# EAGLE design master (EAGLE 6.4)

## Sheet 1 of 2
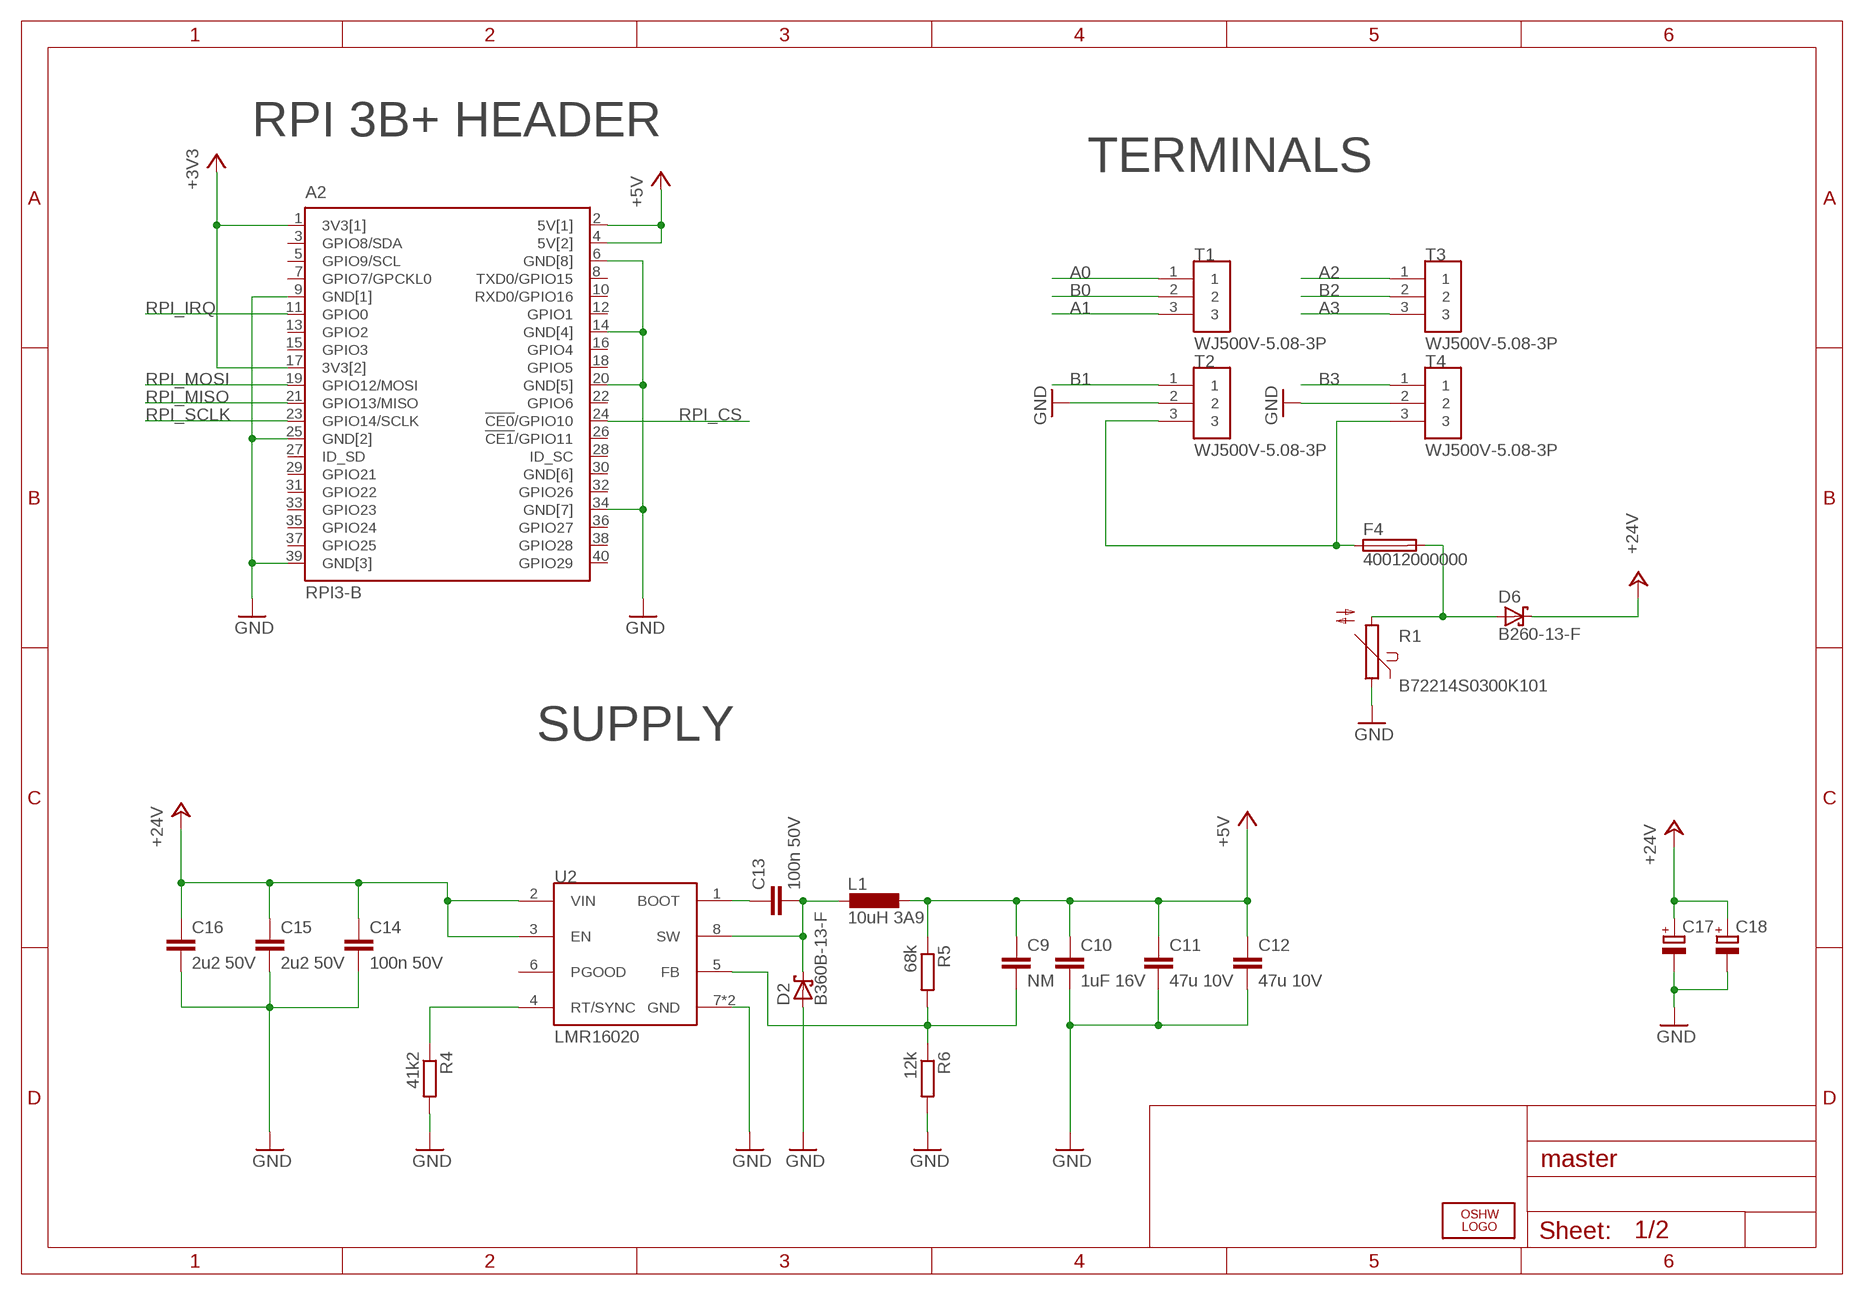
[diagram p0: schematic, sheet 1]

### Parts
A2  RPI3-B  [RPI3-B]
C9  NM  C-EUC0805  [C0805]
C10  1uF 16V  C-EUC0805  [C0805]
C11  47u 10V  C-EUC1210  [C1210]
C12  47u 10V  C-EUC1210  [C1210]
C13  100n 50V  C-EUC1206  [C1206]
C14  100n 50V  C-EUC1206  [C1206]
C15  2u2 50V  C-EUC1206  [C1206]
C16  2u2 50V  C-EUC1206  [C1206]
C17  CPOL-EUUD-5X5,8  [UD-5X5,8_NICHICON]
C18  CPOL-EUUD-5X5,8  [UD-5X5,8_NICHICON]
D2  B360B-13-F  MBRS130LT3  [SMB]
D6  B260-13-F  MBRS130LT3  [SMB]
F4  40012000000  [400]
L1  10uH 3A9  1217AS-H-100M=P3  [1217AS]
LOGO1  OSHW_LOGO_FILLX0350-NT  [OSHW_FILLX350_NOTEXT]
R1  B72214S0300K101  S14K300  [S14K300]
R4  41k2  R-EU_R1206  [R1206]
R5  68k  R-EU_R1206  [R1206]
R6  12k  R-EU_R1206  [R1206]
T1  WJ500V-5.08-3P  [WJ500V-5.08-3P]
T2  WJ500V-5.08-3P  [WJ500V-5.08-3P]
T3  WJ500V-5.08-3P  [WJ500V-5.08-3P]
T4  WJ500V-5.08-3P  [WJ500V-5.08-3P]
U2  LMR16020  [SOIC127P600X170-8N]

### Nets
+3V3: A2.1(3V3[1]) A2.17(3V3[2]) ; also sheet 2
+5V: A2.2(5V[1]) A2.4(5V[2]) C9.1 C10.1 C11.1 C12.1 L1.1 R5.1
+24V: C14.1 C15.1 C16.1 C17.+ C18.+ D6.C U2.2(VIN) U2.3(EN)
A0: T1.1 ; also sheet 2
A1: T1.3 ; also sheet 2
A2: T3.1 ; also sheet 2
A3: T3.3 ; also sheet 2
B0: T1.2 ; also sheet 2
B1: T2.1 ; also sheet 2
B2: T3.2 ; also sheet 2
B3: T4.1 ; also sheet 2
GND: A2.6(GND[8]) A2.9(GND[1]) A2.14(GND[4]) A2.20(GND[5]) A2.25(GND[2]) A2.34(GND[7]) A2.39(GND[3]) C10.2 C11.2 C12.2 C14.2 C15.2 C16.2 C17.- C18.- D2.A R1.1 R4.2 R6.2 T2.2 T4.2 U2.7(GND) U2.9(GND) ; also sheet 2
N$7: R4.1 U2.4(RT/SYNC)
N$8: C9.2 R5.2 R6.1 U2.5(FB)
N$9: C13.2 D2.C L1.2 U2.8(SW)
N$10: C13.1 U2.1(BOOT)
N$19: F4.P$1 T2.3 T4.3
N$20: D6.A F4.P$2 R1.2
RPI_CS: A2.24(!CE0!/GPIO10) ; also sheet 2
RPI_IRQ: A2.11(GPIO0) ; also sheet 2
RPI_MISO: A2.21(GPIO13/MISO) ; also sheet 2
RPI_MOSI: A2.19(GPIO12/MOSI) ; also sheet 2
RPI_SCLK: A2.23(GPIO14/SCLK) ; also sheet 2
Unconnected: A2.3(GPIO8/SDA) A2.5(GPIO9/SCL) A2.7(GPIO7/GPCKL0) A2.8(TXD0/GPIO15) A2.10(RXD0/GPIO16) A2.12(GPIO1) A2.13(GPIO2) A2.15(GPIO3) A2.16(GPIO4) A2.18(GPIO5) A2.22(GPIO6) A2.26(!CE1!/GPIO11) A2.27(ID_SD) A2.28(ID_SC) A2.29(GPIO21) A2.31(GPIO22) A2.32(GPIO26) A2.33(GPIO23) A2.35(GPIO24) A2.36(GPIO27) A2.37(GPIO25) A2.38(GPIO28) A2.40(GPIO29) U2.6(PGOOD)

### Notes on the sheet
- RPI 3B+ HEADER
- TERMINALS
- SUPPLY

## Sheet 2 of 2
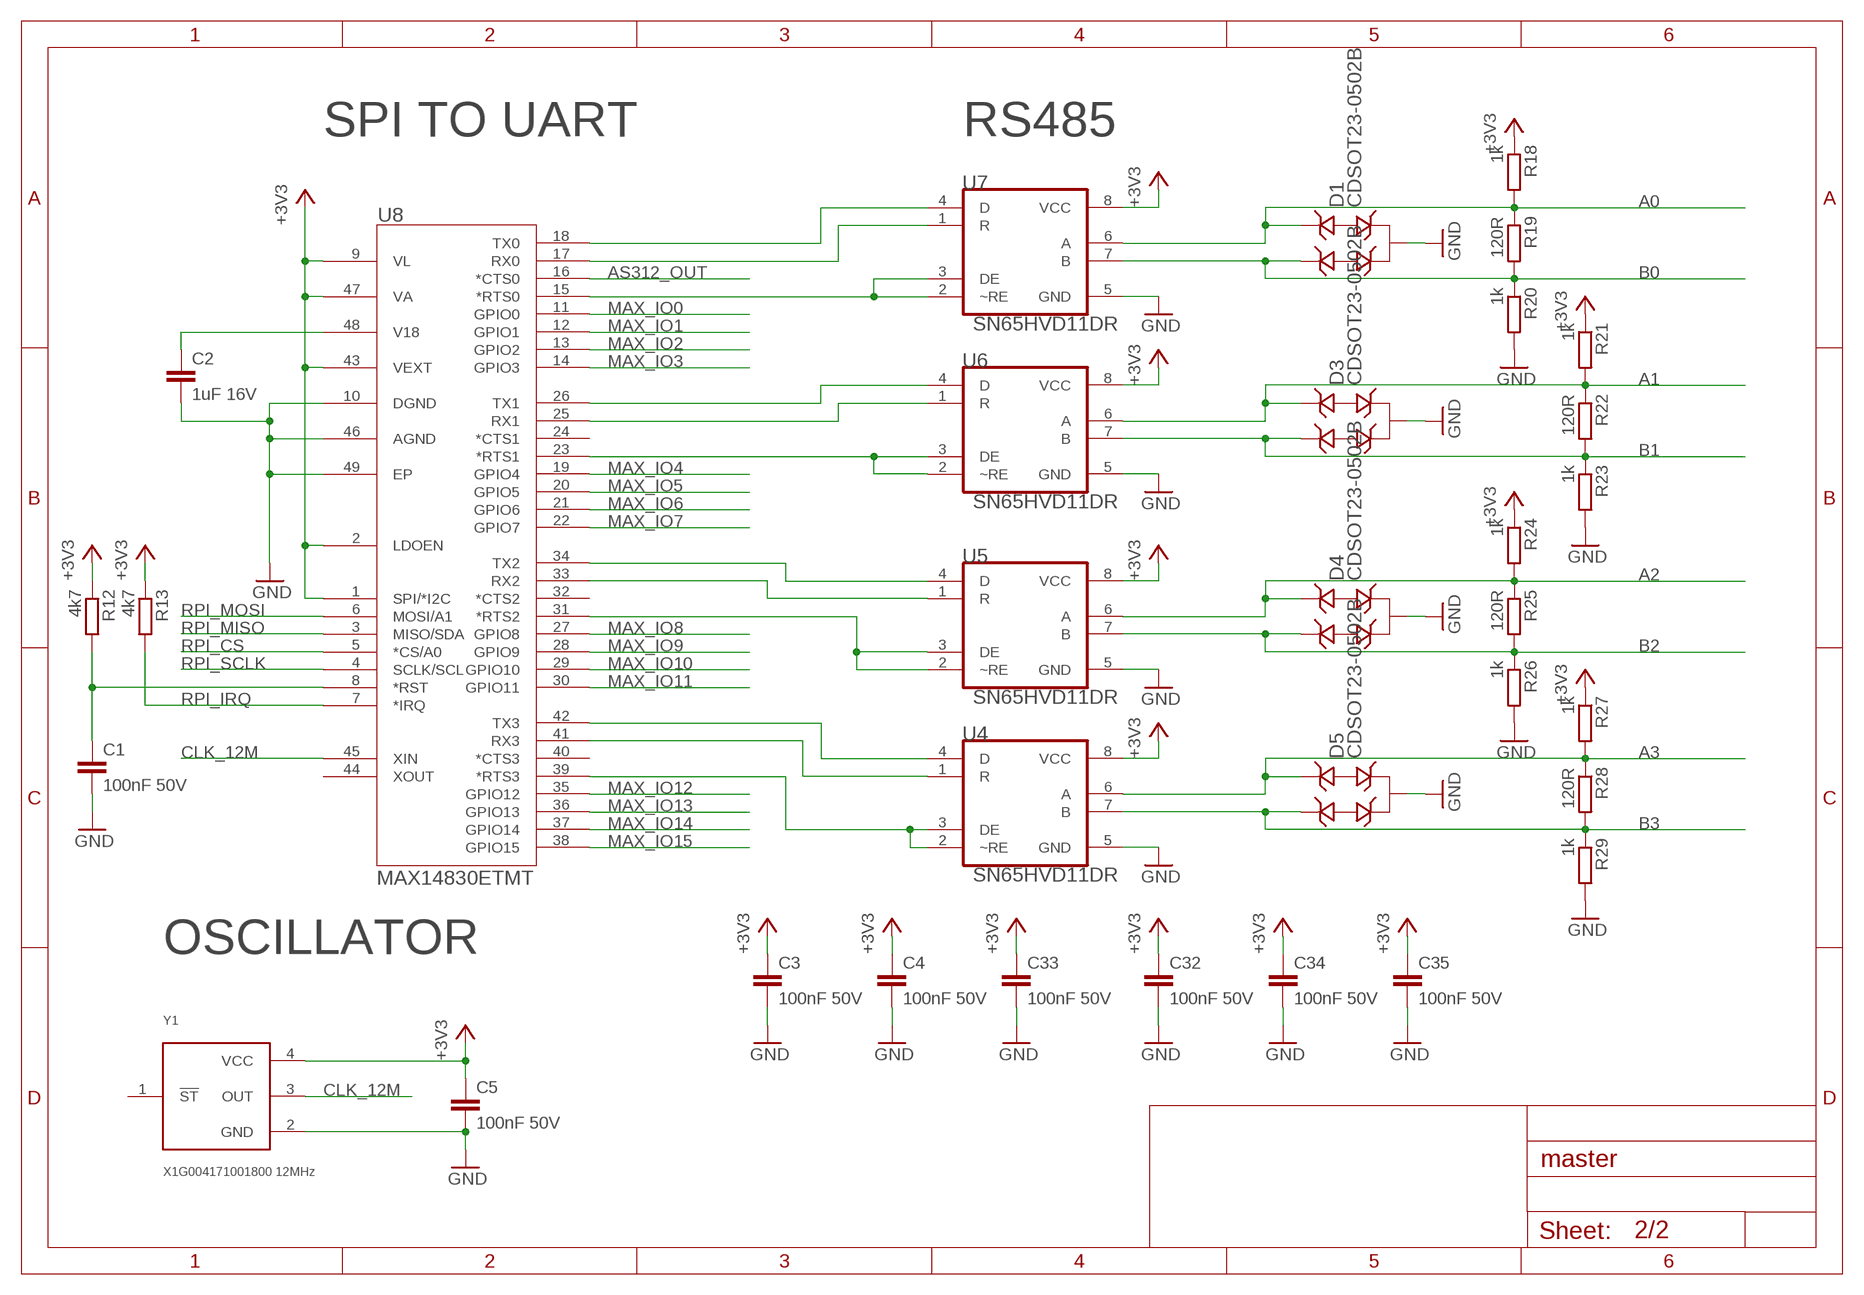
[diagram p1: schematic, sheet 2]

### Parts
C1  100nF 50V  C-EUC0805  [C0805]
C2  1uF 16V  C-EUC0805  [C0805]
C3  100nF 50V  C-EUC0805  [C0805]
C4  100nF 50V  C-EUC0805  [C0805]
C5  100nF 50V  C-EUC0805  [C0805]
C32  100nF 50V  C-EUC0805  [C0805]
C33  100nF 50V  C-EUC0805  [C0805]
C34  100nF 50V  C-EUC0805  [C0805]
C35  100nF 50V  C-EUC0805  [C0805]
D1  CDSOT23-0502B  CDSOT23-SM712  [SOT-23-3]
D3  CDSOT23-0502B  CDSOT23-SM712  [SOT-23-3]
D4  CDSOT23-0502B  CDSOT23-SM712  [SOT-23-3]
D5  CDSOT23-0502B  CDSOT23-SM712  [SOT-23-3]
R12  4k7  R-EU_R1206  [R1206]
R13  4k7  R-EU_R1206  [R1206]
R18  1k  R-EU_R1206  [R1206]
R19  120R  R-EU_R1206  [R1206]
R20  1k  R-EU_R1206  [R1206]
R21  1k  R-EU_R1206  [R1206]
R22  120R  R-EU_R1206  [R1206]
R23  1k  R-EU_R1206  [R1206]
R24  1k  R-EU_R1206  [R1206]
R25  120R  R-EU_R1206  [R1206]
R26  1k  R-EU_R1206  [R1206]
R27  1k  R-EU_R1206  [R1206]
R28  120R  R-EU_R1206  [R1206]
R29  1k  R-EU_R1206  [R1206]
U4  SN65HVD11DR  [SOIC127P600X175-8N]
U5  SN65HVD11DR  [SOIC127P600X175-8N]
U6  SN65HVD11DR  [SOIC127P600X175-8N]
U7  SN65HVD11DR  [SOIC127P600X175-8N]
U8  MAX14830ETMT  [21-0144H_T4877-3]
Y1  X1G004171001800 12MHz  X1G0041710033  [OSCCC250X200X80-4N]

### Nets
+3V3: C3.1 C4.1 C5.1 C32.1 C33.1 C34.1 C35.1 R12.1 R13.1 R18.1 R21.1 R24.1 R27.1 U4.8(VCC) U5.8(VCC) U6.8(VCC) U7.8(VCC) U8.1(SPI/*I2C) U8.2(LDOEN) U8.9(VL) U8.43(VEXT) U8.47(VA) Y1.4(VCC) ; also sheet 1
A0: D1.2(IO2) R18.2 R19.1 U7.6(A) ; also sheet 1
A1: D3.2(IO2) R21.2 R22.1 U6.6(A) ; also sheet 1
A2: D4.2(IO2) R24.2 R25.1 U5.6(A) ; also sheet 1
A3: D5.2(IO2) R27.2 R28.1 U4.6(A) ; also sheet 1
AS312_OUT: U8.16(*CTS0)
B0: D1.1(IO1) R19.2 R20.1 U7.7(B) ; also sheet 1
B1: D3.1(IO1) R22.2 R23.1 U6.7(B) ; also sheet 1
B2: D4.1(IO1) R25.2 R26.1 U5.7(B) ; also sheet 1
B3: D5.1(IO1) R28.2 R29.1 U4.7(B) ; also sheet 1
CLK_12M: U8.45(XIN) Y1.3(OUT)
GND: C1.2 C2.2 C3.2 C4.2 C5.2 C32.2 C33.2 C34.2 C35.2 D1.3(GND) D3.3(GND) D4.3(GND) D5.3(GND) R20.2 R23.2 R26.2 R29.2 U4.5(GND) U5.5(GND) U6.5(GND) U7.5(GND) U8.10(DGND) U8.46(AGND) U8.49(EP) Y1.2(GND) ; also sheet 1
MAX_IO0: U8.11(GPIO0)
MAX_IO1: U8.12(GPIO1)
MAX_IO2: U8.13(GPIO2)
MAX_IO3: U8.14(GPIO3)
MAX_IO4: U8.19(GPIO4)
MAX_IO5: U8.20(GPIO5)
MAX_IO6: U8.21(GPIO6)
MAX_IO7: U8.22(GPIO7)
MAX_IO8: U8.27(GPIO8)
MAX_IO9: U8.28(GPIO9)
MAX_IO10: U8.29(GPIO10)
MAX_IO11: U8.30(GPIO11)
MAX_IO12: U8.35(GPIO12)
MAX_IO13: U8.36(GPIO13)
MAX_IO14: U8.37(GPIO14)
MAX_IO15: U8.38(GPIO15)
N$1: U6.1(R) U8.25(RX1)
N$2: U5.4(D) U8.34(TX2)
N$3: U7.4(D) U8.18(TX0)
N$4: U5.1(R) U8.33(RX2)
N$5: U7.1(R) U8.17(RX0)
N$6: U6.4(D) U8.26(TX1)
N$11: U4.4(D) U8.42(TX3)
N$12: U4.1(R) U8.41(RX3)
N$13: U7.2(~RE) U7.3(DE) U8.15(*RTS0)
N$14: U6.2(~RE) U6.3(DE) U8.23(*RTS1)
N$15: U5.2(~RE) U5.3(DE) U8.31(*RTS2)
N$16: U4.2(~RE) U4.3(DE) U8.39(*RTS3)
N$17: C1.1 R12.2 U8.8(*RST)
N$18: C2.1 U8.48(V18)
RPI_CS: U8.5(*CS/A0) ; also sheet 1
RPI_IRQ: R13.2 U8.7(*IRQ) ; also sheet 1
RPI_MISO: U8.3(MISO/SDA) ; also sheet 1
RPI_MOSI: U8.6(MOSI/A1) ; also sheet 1
RPI_SCLK: U8.4(SCLK/SCL) ; also sheet 1
Unconnected: U8.24(*CTS1) U8.32(*CTS2) U8.40(*CTS3) U8.44(XOUT) Y1.1(!ST)

### Notes on the sheet
- SPI TO UART | RS485
- OSCILLATOR

## Power pins joined to a net without a drawn wire
GND[6]: A2.30(GND[6])

## Library data of the parts
A2 = RPI_HEADER_snapEDA:RPI3-B: Raspberry Pi Zero WH (Zero W with Headers); AVAILABILITY: Unavailable; DESCRIPTION: Raspberry Pi Zero WH _Zero W with Headers_; MF: Raspberry Pi; MP: ADA3708; PACKAGE: None; PRICE: None
C1-C5 C9-C16 C32-C35 = rcl:C-EU: CAPACITOR, European symbol
C17 C18 = rcl:CPOL-EU: POLARIZED CAPACITOR, European symbol
D1 D3-D5 = CDSOT23-SM712_snapEDA:CDSOT23-SM712: Bourns CDSOT23-SM712 http://www.bourns.com/docs/Product-Datasheets/CDSOT23-SM712.pdf TVS Protection Didoe for RS-485 as recommended by TI in their RS-485 Reference Guide: http://www.ti.com/lit/sg/slyt484a/slyt484a.pdf; AVAILABILITY: Unavailable; DESCRIPTION: Diode, Smt Tvs Array, 7vrwm & 12vrwm, Sot23 Package; MF: Bourns; MP: CDSOT23-SM712; PACKAGE: SOT-23 Bourns; PRICE: None
D2 D6 = diode:MBRS130LT3: Schottky Power Rectifier Source: http://www.onsemi.com/pub/Collateral/MBRS130LT3-D.PDF
F4 = 400XXX0000:40012000000
L1 = parts:1217AS-H-100M=P3
LOGO1 = ohw-logo:OSHW_LOGO_FILL
R1 = varistor:S14K300: VARISTOR
R4-R6 R12 R13 R18-R29 = rcl:R-EU_: RESISTOR, European symbol
T1-T4 = parts:WJ500V-5.08-3P
U2 = LMR160X0_snapEDA:LMR16020
U4-U7 = SN65HVD11DR_snapEDA:SN65HVD11DR: 3.3-V RS-485 TRANSCEIVERS; AVAILABILITY: Unavailable; DESCRIPTION: RS-485 Interface ICs 3.3V Differential Transceivers; MF: Texas Instruments; MP: SN65HVD11DR; PACKAGE: SOIC-8 Texas Instruments; PRICE: None
U8 = MAX14830ETMT_snapEDA:MAX14830ETMT; AVAILABILITY: Unavailable; DESCRIPTION: UART 4-CH 128Byte FIFO 2.5V/3.3V 48-Pin TQFN EP; MF: Maxim Integrated; MP: MAX14830ETM+; PACKAGE: TQFN-48 Maxim Integrated; PRICE: None
Y1 = X1G0041710033_snapEDA:X1G0041710033: Oscillator, Spxo, Sg-210stf, 25 Mhz, Smd; AVAILABILITY: Unavailable; DESCRIPTION: Oscillator, Spxo, Sg-210stf, 25 Mhz, Smd; MF: EPSON; MP: X1G0041710033; PACKAGE: None; PRICE: None

## Board
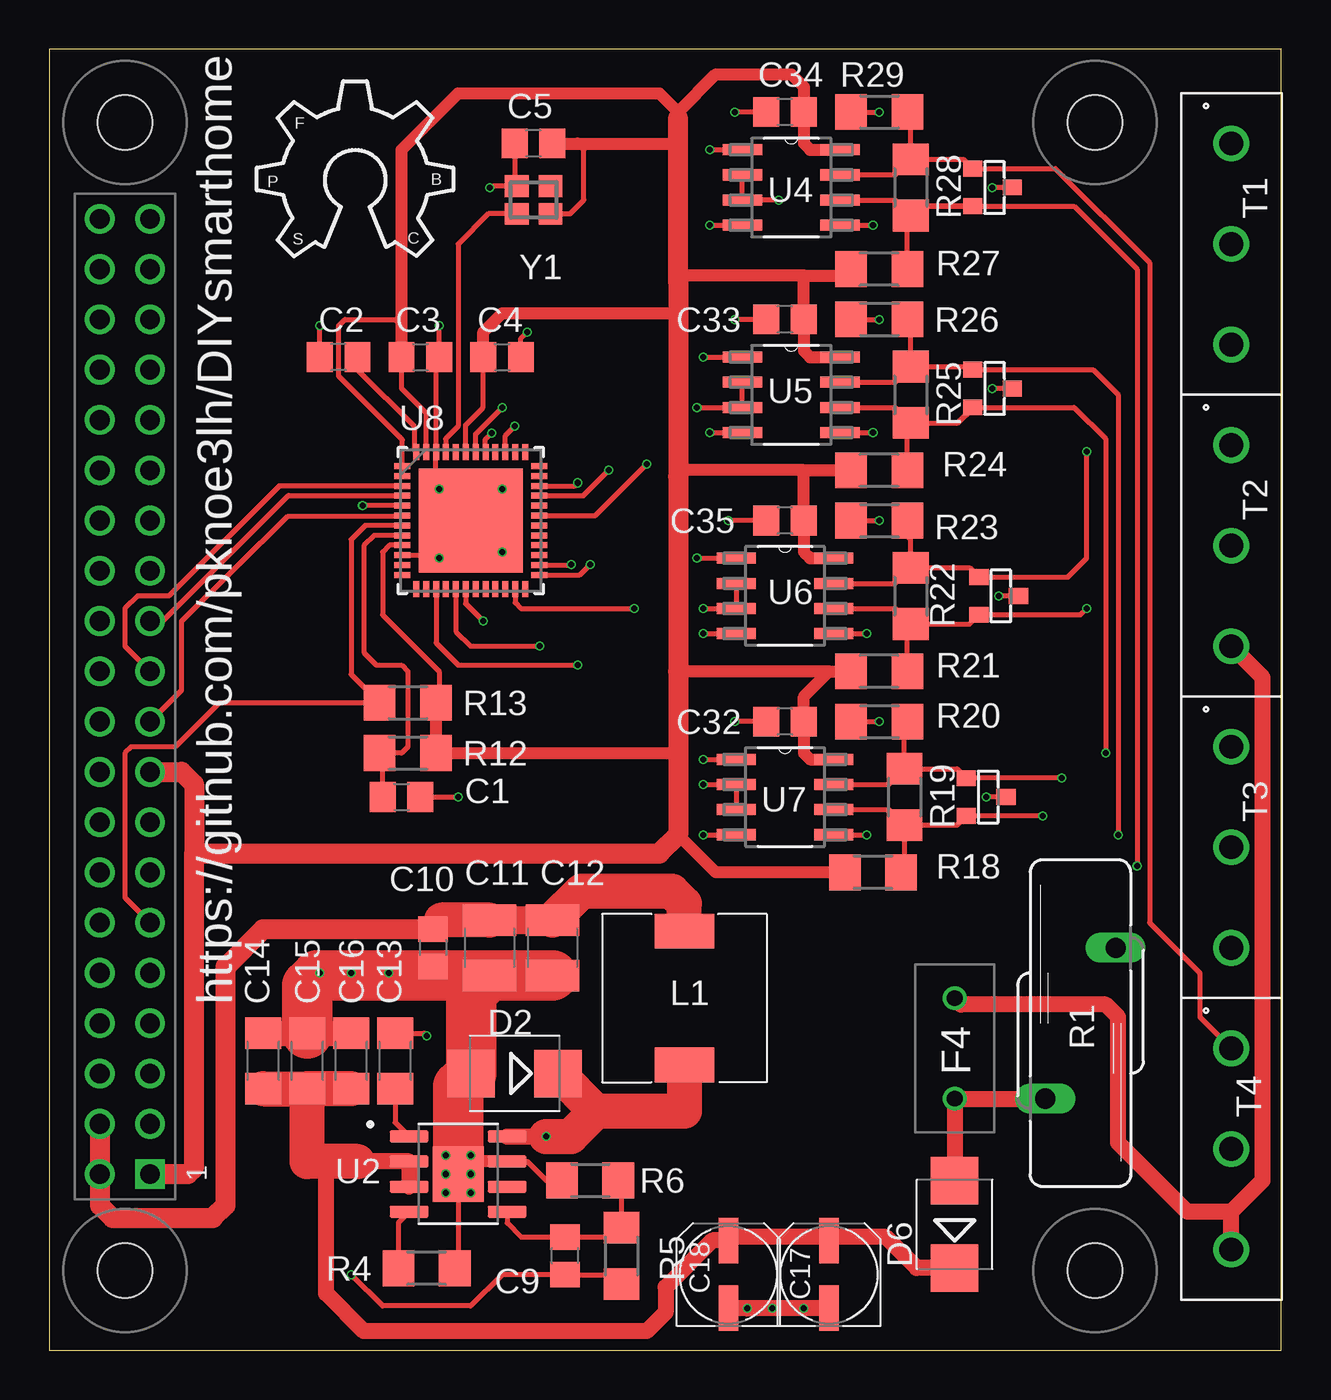
[diagram p2: board, top side]
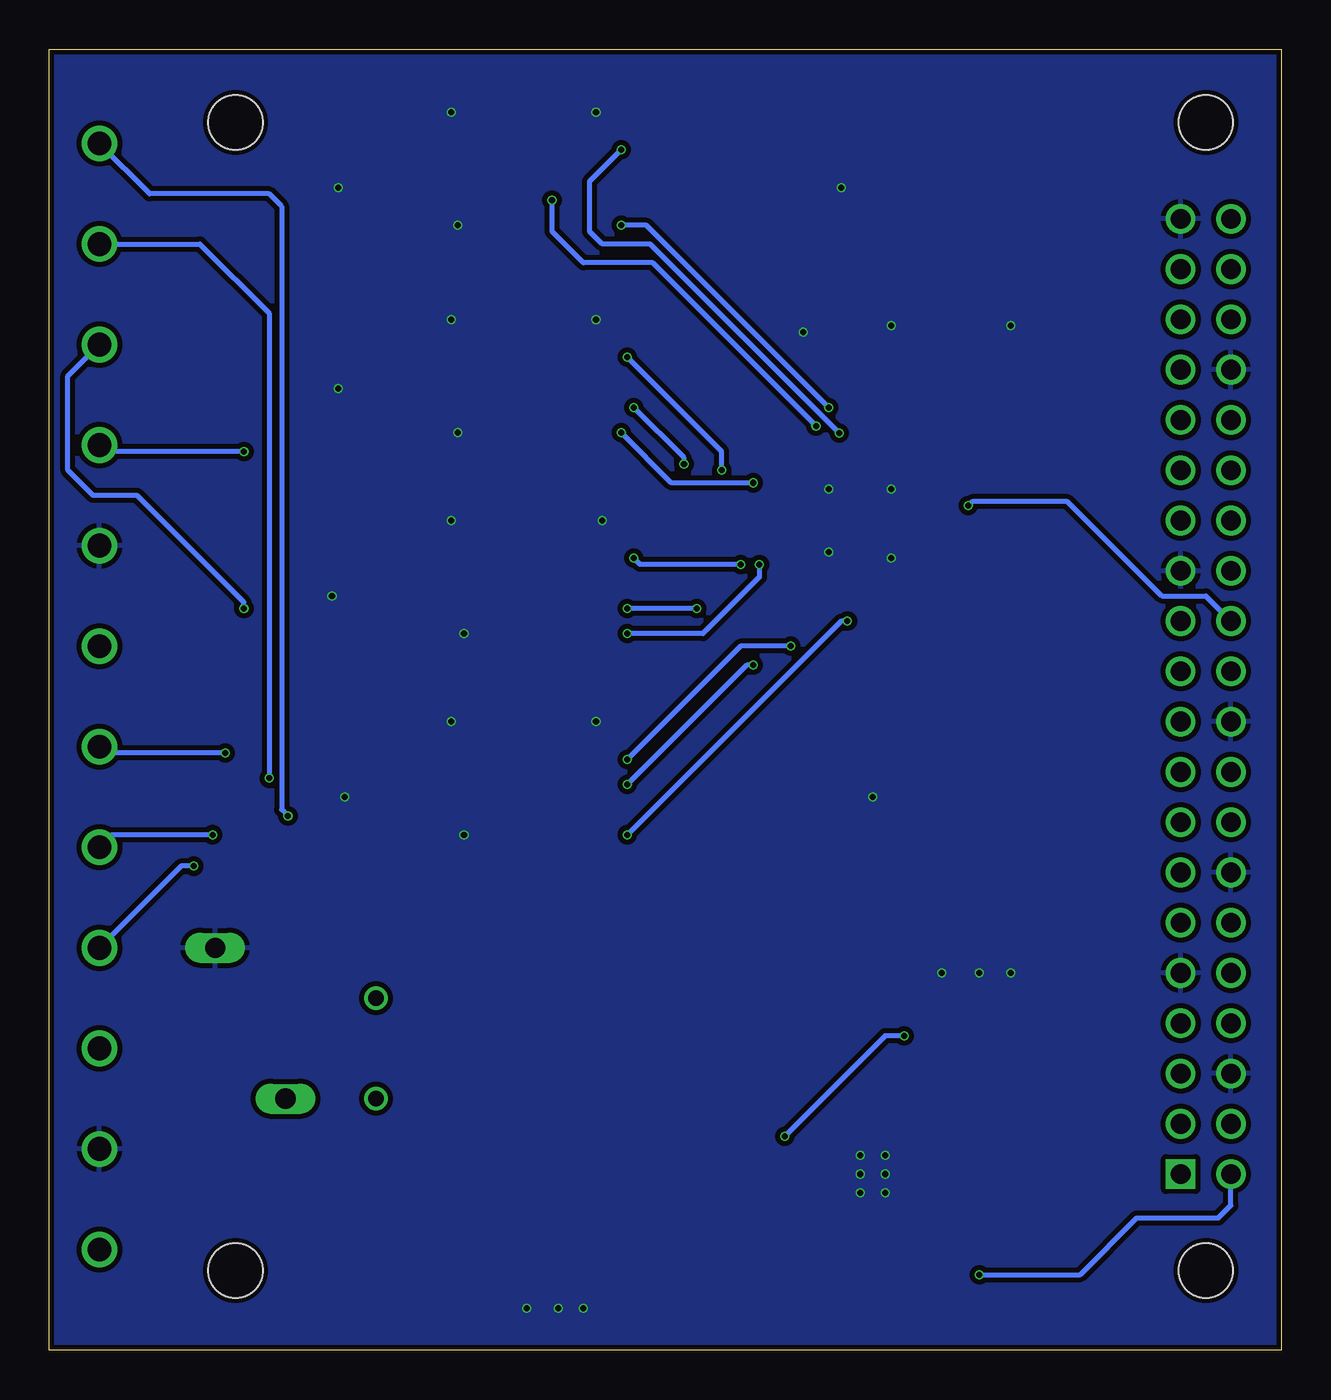
[diagram p3: board, bottom side, seen from below]

Size 62.21 x 65.71 mm. Coordinates in mm from the lower left corner, seen from the top.
Outline: 0,0 62.21,0 62.21,65.71 0,65.71 0,0
Copper layers (1*16): Top 0.035559375mm / dielectric 1.6mm / Bottom 0.035559375mm
Design rules "jlcpcb2layer": minimum track width 5mil, minimum drill 12mil, track to track 5mil, track to pad 5mil, pad to pad 5mil, via to via 5mil, smd to smd 5mil, copper to edge 8mil, drill to drill 6mil, minimum pad ring 5mil, minimum via ring 3mil, stop-mask expansion 2.5mil, vias tented up to drill 0mil, thermal gap 10mil
Holes 2.75 mm at 52.81,62.02 52.81,4.02

### Footprints (pad centres in the part's own frame; a part is rotated, then mirrored left to right if it is on the bottom)
RPI3-B = drill 1 square: 1 -24.13,-1.27 | drill 1: 2 -24.13,1.27; 3 -21.59,-1.27; 4 -21.59,1.27; 5 -19.05,-1.27; 6 -19.05,1.27; 7 -16.51,-1.27; 8 -16.51,1.27; 9 -13.97,-1.27; 10 -13.97,1.27; 11 -11.43,-1.27; 12 -11.43,1.27; 13 -8.89,-1.27; 14 -8.89,1.27; 15 -6.35,-1.27; 16 -6.35,1.27; 17 -3.81,-1.27; 18 -3.81,1.27; 19 -1.27,-1.27; 20 -1.27,1.27; 21 1.27,-1.27; 22 1.27,1.27; 23 3.81,-1.27; 24 3.81,1.27; 25 6.35,-1.27; 26 6.35,1.27; 27 8.89,-1.27; 28 8.89,1.27; 29 11.43,-1.27; 30 11.43,1.27; 31 13.97,-1.27; 32 13.97,1.27; 33 16.51,-1.27; 34 16.51,1.27; 35 19.05,-1.27; 36 19.05,1.27; 37 21.59,-1.27; 38 21.59,1.27; 39 24.13,-1.27; 40 24.13,1.27 | hole 2.75: -29,0; 29,0
C0805 = smd 1.3 x 1.5: 1 -0.95,0; 2 0.95,0
C1210 = smd 1.6 x 2.7: 1 -1.4,0; 2 1.4,0
C1206 = smd 1.6 x 1.8: 1 -1.4,0; 2 1.4,0
UD-5X5,8_NICHICON = smd 2.3 x 1: + 1.725,0; - -1.7,0
SOT-23-3 = smd 0.802 x 0.972: 1 -0.95,-1; 2 0.95,-1; 3 0,1
SMB = smd 2.4 x 2.4: A 2.2,0; C -2.2,0
400 = drill 0.8: P$1 -2.54,0; P$2 2.54,0
1217AS = smd 1.75 x 3: 1 -3.375,0; 2 3.375,0
S14K300 = drill 1.016 long: 1 -1.778,-3.81; 2 1.778,3.81
R1206 = smd 1.6 x 1.803: 1 -1.422,0; 2 1.422,0
WJ500V-5.08-3P = drill 1.2: 1 -5.08,0; 2 0,0; 3 5.08,0
SOIC127P600X170-8N = smd 1.97 x 0.6: 1 -2.475,1.905; 2 -2.475,0.635; 3 -2.475,-0.635; 4 -2.475,-1.905; 5 2.475,-1.905; 6 2.475,-0.635; 7 2.475,0.635; 8 2.475,1.905 | smd 2.58 x 2.8: 9 0,0
SOIC127P600X175-8N = smd 1.981 x 0.559: 1 -2.464,1.905; 2 -2.464,0.635; 3 -2.464,-0.635; 4 -2.464,-1.905; 5 2.464,-1.905; 6 2.464,-0.635; 7 2.464,0.635; 8 2.464,1.905
21-0144H_T4877-3 = smd 0.813 x 0.305: 1 -3.454,2.75; 2 -3.454,2.25; 3 -3.454,1.75; 4 -3.454,1.25; 5 -3.454,0.75; 6 -3.454,0.25; 7 -3.454,-0.25; 8 -3.454,-0.75; 9 -3.454,-1.25; 10 -3.454,-1.75; 11 -3.454,-2.25; 12 -3.454,-2.75; 25 3.454,-2.75; 26 3.454,-2.25; 27 3.454,-1.75; 28 3.454,-1.25; 29 3.454,-0.75; 30 3.454,-0.25; 31 3.454,0.25; 32 3.454,0.75; 33 3.454,1.25; 34 3.454,1.75; 35 3.454,2.25; 36 3.454,2.75 | smd 0.305 x 0.813: 13 -2.75,-3.454; 14 -2.25,-3.454; 15 -1.75,-3.454; 16 -1.25,-3.454; 17 -0.75,-3.454; 18 -0.25,-3.454; 19 0.25,-3.454; 20 0.75,-3.454; 21 1.25,-3.454; 22 1.75,-3.454; 23 2.25,-3.454; 24 2.75,-3.454; 37 2.75,3.454; 38 2.25,3.454; 39 1.75,3.454; 40 1.25,3.454; 41 0.75,3.454; 42 0.25,3.454; 43 -0.25,3.454; 44 -0.75,3.454; 45 -1.25,3.454; 46 -1.75,3.454; 47 -2.25,3.454; 48 -2.75,3.454 | smd 5.258 x 5.258: 49 0,0
OSCCC250X200X80-4N = smd 1.2 x 1.1: 1 -0.853,-0.704; 2 0.847,-0.704; 3 0.847,0.696; 4 -0.853,0.696

### Placement (x,y rotation side)
A2  3.81,33.02 90 top
C1  17.78,27.94 0 top
C2  14.61,50.17 180 top
C3  18.73,50.17 0 top
C4  22.86,50.17 0 top
C5  24.45,60.96 180 top
C9  26.04,4.76 90 top
C10  19.37,20.32 270 top
C11  22.22,20.32 270 top
C12  25.4,20.32 270 top
C13  17.46,14.61 90 top
C14  10.79,14.61 90 top
C15  13.02,14.61 90 top
C16  15.24,14.61 90 top
C17  39.37,3.81 90 top
C18  34.29,3.81 90 top
C32  37.15,31.75 180 top
C33  37.15,52.07 180 top
C34  37.15,62.55 180 top
C35  37.15,41.91 180 top
D1  47.31,27.94 270 top
D2  23.49,13.97 180 top
D3  47.94,38.1 270 top
D4  47.62,48.58 270 top
D5  47.62,58.74 270 top
D6  45.72,6.35 90 top
F4  45.72,15.24 270 top
L1  32.07,17.78 270 top
LOGO1  10.48,55.25 0 top
R1  52.07,16.51 180 top
R4  19.05,4.13 0 top
R5  28.89,4.76 90 top
R6  27.3,8.57 180 top
R12  18.1,30.16 180 top
R13  18.1,32.7 180 top
R18  41.59,24.13 0 top
R19  43.18,27.94 90 top
R20  41.91,31.75 180 top
R21  41.91,34.29 0 top
R22  43.5,38.1 90 top
R23  41.91,41.91 180 top
R24  41.91,44.45 0 top
R25  43.5,48.26 90 top
R26  41.91,52.07 180 top
R27  41.91,54.61 0 top
R28  43.5,58.74 90 top
R29  41.91,62.55 180 top
T1  59.69,55.88 270 top
T2  59.69,40.64 270 top
T3  59.69,25.4 270 top
T4  59.69,10.16 270 top
U2  20.64,8.89 0 top
U4  37.47,58.74 0 top
U5  37.47,48.26 0 top
U6  37.15,38.1 0 top
U7  37.15,27.94 0 top
U8  21.27,41.91 0 top
Y1  24.45,58.1 180 top

### Tracks (layer width: path | path; a pad name or v marks a point on that pad's centre or on a via)
+3V3
  Top 0.254: U8.47 19.02,47.34 17.78,48.58 C3.1 | U8.43 21.02,46.74 21.91,47.62 C4.1 | Y1.4 26.29,57.41 26.99,58.1 26.99,60.64 26.67,60.96 | U8.2 U8.1 17.82,46 14.61,49.21 14.61,51.75 14.92,52.07 17.46,52.07 17.78,51.75 | U8.9 17.16,40.66 16.83,40.32 16.83,37.15 19.68,34.29 19.68,32.87 R13.1
  Top 0.61: C3.1 17.78,51.75 17.78,52.39 17.78,60.64 20.64,63.5 30.8,63.5 31.75,62.55 | 31.75,30.16 R12.1 R13.1 | 31.75,62.23 31.75,62.55 | 31.75,62.55 33.66,64.45 37.47,64.45 38.1,63.82 C34.1 38.1,60.96 38.42,60.64 U4.8 | 38.1,54.29 C33.1 38.1,50.48 38.42,50.17 U5.8 | 38.1,54.29 32.07,54.29 31.75,53.98 | 38.1,54.29 40.17,54.29 R27.1 | 38.1,44.45 C35.1 38.1,40.33 38.42,40.01 U6.8 | 38.1,44.45 32.07,44.45 31.75,44.13 | 38.1,44.45 R24.1 | 39.37,34.29 38.1,33.02 C32.1 38.1,30.17 38.42,29.85 U7.8 | 39.37,34.29 R21.1 | 39.37,34.29 31.75,34.29 | R18.1 33.66,24.13 31.75,26.04 | C5.1 26.67,60.96 31.43,60.96 31.75,60.64 | C4.1 21.91,51.44 22.86,52.39 31.75,52.39
  Top 1.016: A2.1 6.98,8.89 7.3,9.21 7.3,25.08 | A2.17 6.67,29.21 7.3,28.58 7.3,25.08 | 31.75,62.23 31.75,60.64 31.75,53.98 31.75,52.39 31.75,44.13 31.75,34.29 31.75,30.16 31.75,26.04 30.8,25.08 7.3,25.08
+5V  (via drill 0.3)
  Top 0.254: R5.1 28.42,3.81 C9.1 22.86,3.81 21.27,2.22 16.83,2.22 v15.24,3.81
  Top 0.813: A2.4 A2.2
  Top 1.016: 19.81,21.72 19.81,21.71 C10.1 10.79,21.27 8.89,19.37 8.89,7.3 8.26,6.67 3.17,6.67 2.54,7.3 A2.4
  Top 1.422: C11.1 C12.1
  Top 1.778: L1.1 32.07,22.54 31.43,23.18 26.86,23.18 C12.1 | C11.1 19.81,21.72
  Bottom 0.254: v15.24,3.81 10.16,3.81 7.3,6.67 3.17,6.67 2.54,7.3 A2.2
+24V
  Top 0.813: D6.C 43.79,4.15 42.23,5.72 39.55,5.72 C17.+ 39.23,5.54 39.05,5.72 34.47,5.72 C18.+ 33.48,5.54 31.11,3.18 31.11,1.91 30.16,0.95 15.88,0.95 13.97,2.86 13.97,9.53 | 15.56,9.53 U2.2 U2.3
  Top 1.778: 15.56,9.53 13.97,9.53 13.02,9.53 C15.1 | C14.1 C15.1 | C16.1 C15.1
A0  (via drill 0.3)
  Top 0.254: U7.6 42.39,27.31 R19.1 | R19.1 45.84,26.52 D1.2 v50.16,26.99 | R19.1 43.18,24.3 R18.2
  Bottom 0.254: v50.16,26.99 50.48,27.31 50.48,57.79 51.12,58.42 57.15,58.42 T1.1
A1  (via drill 0.3)
  Top 0.254: U6.6 42.71,37.47 R22.1 | R22.1 46.47,36.68 D3.2 52.07,37.15 v52.39,37.47 | R21.2 43.33,36.51 R22.1
  Bottom 0.254: v52.39,37.47 52.39,37.78 57.79,43.18 60.01,43.18 61.28,44.45 61.28,49.21 T1.3
A2  (via drill 0.3)
  Top 0.254: U5.6 42.71,47.62 R25.1 | R25.1 45.84,46.84 | 45.84,46.84 D4.2 | R24.2 43.33,46.67 R25.1 | 45.84,46.84 45.89,46.84 46.67,47.62 51.75,47.62 53.34,46.04 v53.34,30.16
  Bottom 0.254: v53.34,30.16 59.37,30.16 T3.1
A3  (via drill 0.3)
  Top 0.254: U4.6 42.71,58.1 R28.1 | D5.2 43.97,57.79 R28.1 | R28.1 43.33,57.15 R27.2 43.33,57.32 43.18,57.47 43.5,57.79 51.75,57.79 54.93,54.61 v54.93,24.45
  Bottom 0.254: v54.93,24.45 55.56,24.45 T3.3
B0  (via drill 0.3)
  Top 0.254: U7.7 42.39,28.58 R19.2 | R19.2 45.84,29.36 D1.1 v51.12,28.89 | R19.2 43.18,31.6 R20.1
  Bottom 0.254: T1.2 54.61,55.88 51.12,52.39 v51.12,28.89
B1  (via drill 0.3)
  Top 0.254: U6.7 42.71,38.73 R22.2 | R22.2 46.47,39.52 D3.1 51.43,39.05 52.39,40.01 v52.39,45.4 | R22.2 43.5,40.96 43.18,41.28 43.18,41.76 R23.1
  Bottom 0.254: v52.39,45.4 59.37,45.4 T2.1
B2  (via drill 0.3)
  Top 0.254: U5.7 42.71,48.9 R25.2 | R25.2 46.47,49.68 D4.1 52.71,49.53 53.98,48.26 v53.98,26.04 | R25.2 43.5,51.9 R26.1
  Bottom 0.254: v53.98,26.04 59.05,26.04 T3.2
B3
  Top 0.254: U4.7 42.71,59.37 R28.2 | R28.2 46.15,60.16 D5.1 50.8,59.69 55.56,54.93 55.56,21.59 58.1,19.05 58.1,16.83 T4.1 | R28.2 43.5,62.38 R29.1
CLK_12M
  Top 0.254: Y1.3 22.16,57.41 20.64,55.88 20.64,46.67 20,46.04 20,45.38 U8.45
GND  (via drill 0.3)
  Top 0.254: U2.7 24.13,9.53 25.08,8.57 R6.2 | U2.9 20.64,4.29 R4.2 | 15.56,19.56 14.92,18.92 | U8.10 17.85,40.13 18.82,40.13 20.6,41.91 U8.49 21.27,42.53 19.51,44.3 19.51,45.35 U8.46 19.52,50.01 C3.2 v19.68,51.75 | C1.2 v20.64,27.94 | C4.2 23.81,51.12 v24.13,51.44 | C2.2 v13.66,51.75 v13.65,51.75 | C5.2 23.5,58.91 Y1.2 22.29,58.81 v22.22,58.74 | D5.3 v47.62,58.74 | D4.3 v47.62,48.58 | D3.3 v47.94,38.1 | D1.3 v47.31,27.94 | U4.5 v41.59,56.83 | R29.2 v41.91,62.55 | C34.2 v34.61,62.55 | C33.2 v34.61,52.07 | R26.2 v41.91,52.07 | U5.5 v41.59,46.36 | C35.2 v34.29,41.91 | R23.2 v41.91,41.91 | U6.5 v41.28,36.2 | C32.2 v34.61,31.75 | R20.2 v41.91,31.75 | U7.5 v41.28,26.04
  Top 0.406: C10.2 20.19,19.37 20.64,18.92
  Top 0.61: U2.7 20.64,9.53
  Top 0.813: C17.- C18.- v35.24,2.11 | v13.65,19.05 13.65,18.92
  Top 1.27: C14.2 C15.2 C16.2
  Top 2.54: U2.9 20.64,9.53 20.64,13.31 D2.A 21.29,17.99 C11.2 | C12.2 C11.2 | C11.2 20.64,18.92 14.92,18.92 13.65,18.92 13.52,18.92 13.02,18.42 C15.2
  other vias: 19.68,43.5 19.68,40.01 22.86,43.5 22.86,40.32 20,9.84 21.27,9.84 21.27,8.89 20,8.89 20,7.94 21.27,7.94 15.24,19.05 17.14,19.05 36.51,2.11 38.1,2.11
  pour Bottom (isolate 0.254): 0,0 62.23,0 62.23,65.72 0,65.72
N$1  (via drill 0.3)
  Top 0.254: U8.25 26.78,39.16 v27.3,39.69 | v32.7,40.01 U6.1
  Bottom 0.254: v27.3,39.69 32.38,39.69 v32.7,40.01
N$2  (via drill 0.3)
  Top 0.254: U8.34 26.51,43.66 v26.67,43.82 | v33.34,46.36 U5.4
  Bottom 0.254: v26.67,43.82 30.8,43.82 v33.34,46.36
N$3  (via drill 0.3)
  Top 0.254: U8.18 21.02,37.72 v21.91,36.83 | v33.02,26.04 U7.4
  Bottom 0.254: v21.91,36.83 22.22,36.83 v33.02,26.04
N$4  (via drill 0.3)
  Top 0.254: U8.33 26.97,43.16 v28.26,44.45 | v33.02,50.17 U5.1
  Bottom 0.254: v28.26,44.45 28.26,45.4 v33.02,50.17
N$5  (via drill 0.3)
  Top 0.254: U8.17 20.52,36.31 21.27,35.56 v24.76,35.56 | v33.02,29.85 U7.1
  Bottom 0.254: v24.76,35.56 27.3,35.56 v33.02,29.85
N$6  (via drill 0.3)
  Top 0.254: U8.26 26.32,39.66 v26.35,39.69 | v33.02,36.2 U6.4
  Bottom 0.254: v26.35,39.69 26.35,39.05 29.21,36.2 v33.02,36.2
N$7
  Top 0.254: R4.1 17.63,6.45 U2.4
N$8
  Top 0.254: U2.5 23.11,6.42 23.81,5.72 C9.2 28.42,5.71 R5.2 28.89,8.41 R6.1
N$9  (via drill 0.3)
  Top 0.254: C13.2 18.92,16.01 v19.05,15.88
  Top 0.813: U2.8 v25.08,10.8
  Top 1.778: L1.2 32.07,12.07 27.6,12.07 | 27.6,12.07 D2.C | v25.08,10.8 26.33,10.8 27.6,12.07
  Bottom 0.254: v19.05,15.88 20,15.88 v25.08,10.8
N$10
  Top 0.254: C13.1 17.46,11.5 U2.1
N$11  (via drill 0.3)
  Top 0.254: U8.42 21.52,46.29 v22.86,47.62 | v33.34,56.83 U4.4
  Bottom 0.254: v22.86,47.62 32.07,56.83 v33.34,56.83
N$12  (via drill 0.3)
  Top 0.254: U8.41 22.01,45.38 22.01,46.02 v22.33,46.34 | v33.34,60.64 U4.1
  Bottom 0.254: v22.33,46.34 31.87,55.88 34.29,55.88 34.92,56.52 34.92,59.06 v33.34,60.64
N$13  (via drill 0.3)
  Top 0.254: U8.15 19.52,35.72 20.64,34.61 v26.67,34.61 | v33.02,28.58 U7.2 U7.3
  Bottom 0.254: v26.67,34.61 26.99,34.61 v33.02,28.58
N$14  (via drill 0.3)
  Top 0.254: U8.23 23.52,37.76 23.81,37.47 v29.53,37.47 | v33.02,37.47 U6.3 U6.2
  Bottom 0.254: v29.53,37.47 v33.02,37.47
N$15  (via drill 0.3)
  Top 0.254: U8.31 27.55,42.16 v30.16,44.77 | v32.7,47.62 U5.3 U5.2
  Bottom 0.254: v30.16,44.77 30.16,45.09 v32.7,47.62
N$16  (via drill 0.3)
  Top 0.254: U8.39 23.02,46.2 v23.49,46.67 | v36.83,58.1 U4.3 U4.2
  Bottom 0.254: v23.49,46.67 31.75,54.93 35.24,54.93 36.83,56.52 v36.83,58.1
N$17
  Top 0.254: 16.51,30 R12.2 | C1.1 16.83,30.01 R12.2 | R12.2 17.78,30.16 18.1,30.48 18.1,34.29 17.78,34.61 16.51,34.61 15.88,35.24 15.88,40.64 16.39,41.16 U8.8
N$18
  Top 0.254: C2.1 15.55,49.53 18.41,46.67 18.41,45.47 U8.48
N$19
  Top 0.813: T4.3 59.69,6.99 | 59.69,6.99 61.28,8.57 61.28,33.97 T2.3 | 59.69,6.99 57.47,6.99 53.98,10.48 53.98,16.83 53.34,17.46 46.04,17.46 F4.P$1
N$20
  Top 0.813: D6.A F4.P$2 R1.2 50.8,12.7
RPI_CS  (via drill 0.3)
  Top 0.254: U8.5 15.87,42.66 v15.81,42.67
  Bottom 0.254: A2.24 3.81,38.1 6.03,38.1 10.79,42.86 15.62,42.86 v15.81,42.67
RPI_IRQ
  Top 0.254: 16.51,32.87 R13.2 | R13.2 8.57,32.7 6.35,30.48 4.13,30.48 3.81,30.16 3.81,22.86 A2.11 | U8.7 15.94,41.66 15.24,40.96 15.24,34.14 R13.2
RPI_MISO
  Top 0.254: U8.3 11.59,43.66 6.03,38.1 4.45,38.1 3.81,37.47 3.81,35.56 A2.21
RPI_MOSI
  Top 0.254: A2.19 6.67,33.34 6.67,36.83 12.04,42.13 17.72,42.13 U8.6
RPI_SCLK
  Top 0.254: A2.23 5.71,36.83 12.07,43.18 17.8,43.18 U8.4

### Text on the board
tPlace: https://github.com/pknoe3lh/DIYsmarthome